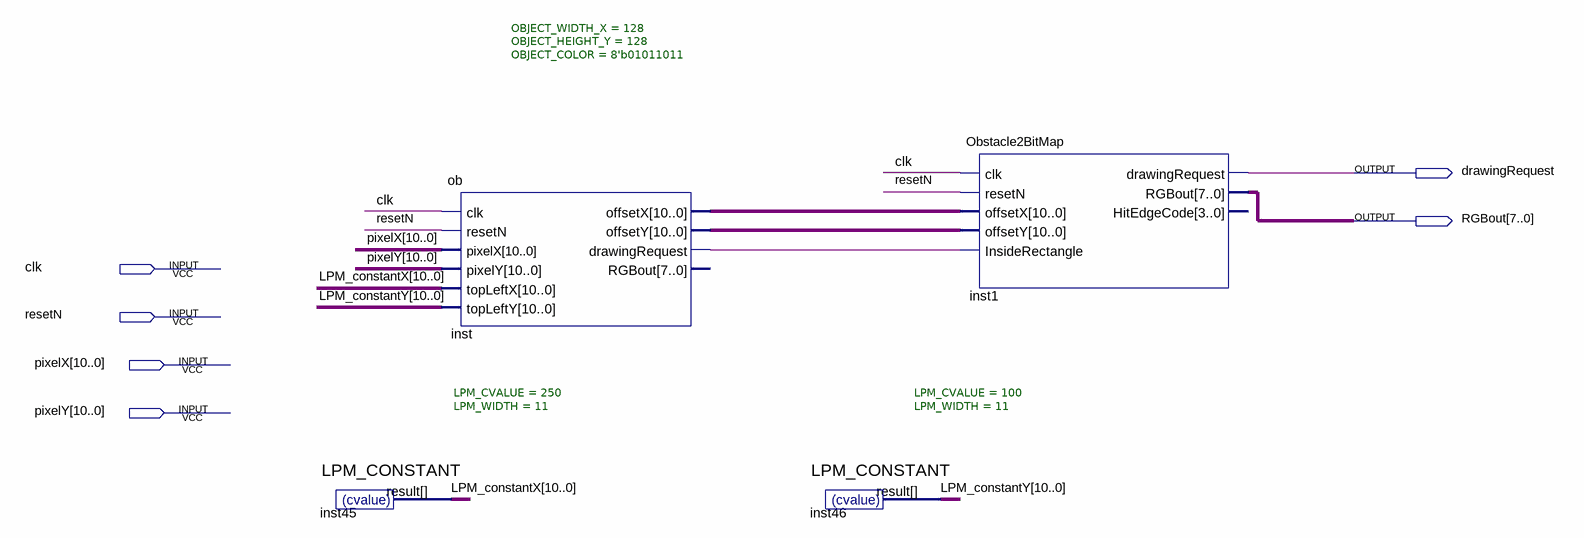
[diagram p0: schematic sheet]
// Quartus schematic Obstacle2.bdf as structural Verilog: 4 symbols, 6 pins
module Obstacle2 (
  input  clk,
  input  resetN,
  input  [10:0] pixelX,
  input  [10:0] pixelY,
  output drawingRequest,
  output [7:0] RGBout
);

  wire inst_drawingrequest;
  wire [10:0] inst_offsetx, inst_offsety, LPM_constantX, LPM_constantY;

  LPM_CONSTANT #(.LPM_CVALUE(250), .LPM_WIDTH(11)) inst45 (.result(LPM_constantX));
  ob #(.OBJECT_WIDTH_X(128), .OBJECT_HEIGHT_Y(128), .OBJECT_COLOR(8'b01011011)) inst (
    .clk(clk), .resetN(resetN), .pixelX(pixelX), .pixelY(pixelY), .topLeftX(LPM_constantX),
    .topLeftY(LPM_constantY), .offsetX(inst_offsetx), .offsetY(inst_offsety),
    .drawingRequest(inst_drawingrequest));  // open: RGBout
  LPM_CONSTANT #(.LPM_CVALUE(100), .LPM_WIDTH(11)) inst46 (.result(LPM_constantY));
  Obstacle2BitMap inst1 (
    .clk(clk), .resetN(resetN), .offsetX(inst_offsetx), .offsetY(inst_offsety),
    .InsideRectangle(inst_drawingrequest), .drawingRequest(drawingRequest), .RGBout(RGBout));  // open: HitEdgeCode
endmodule
